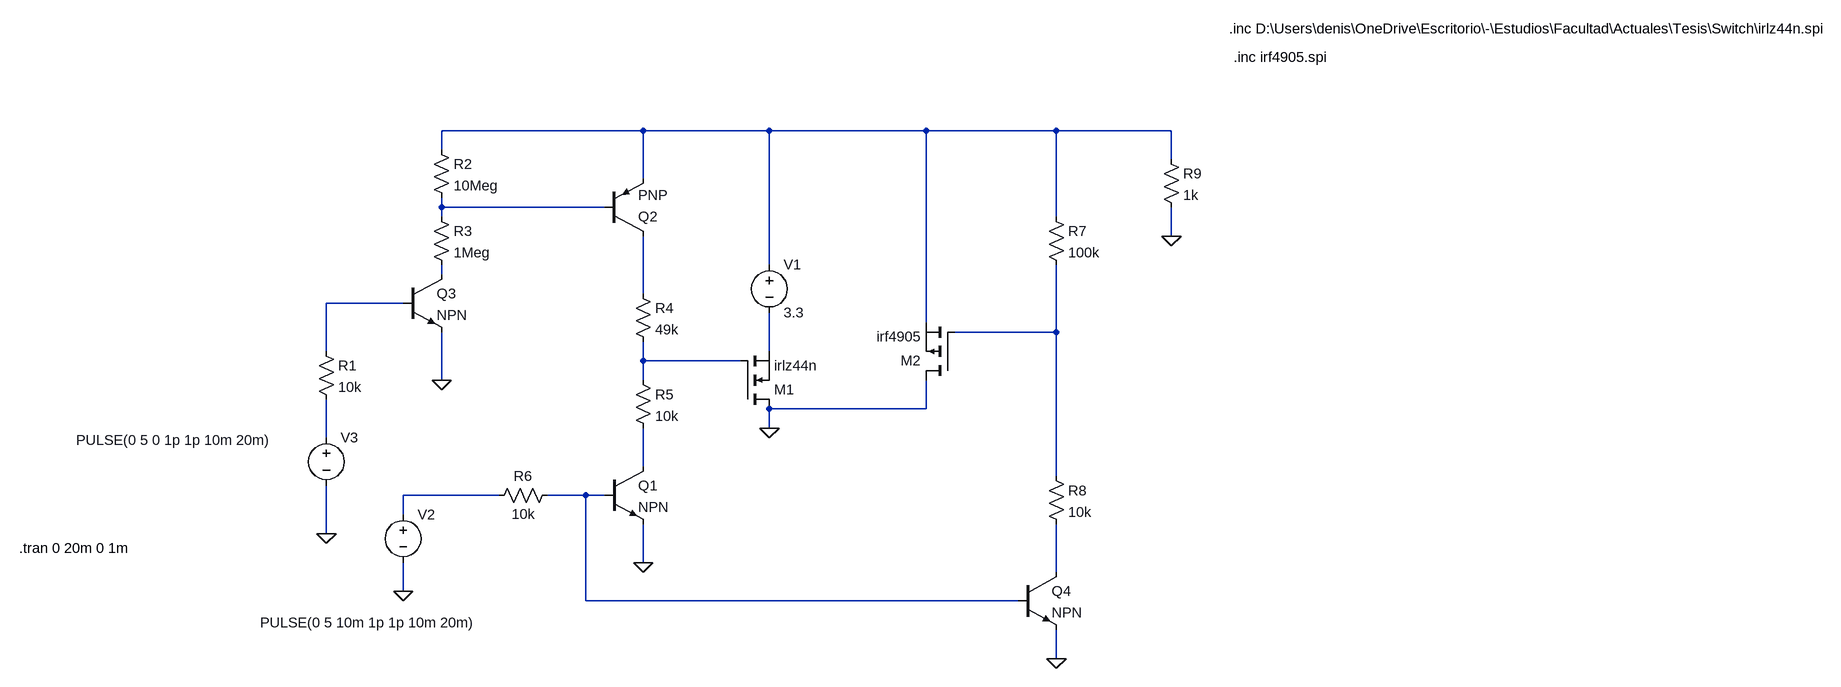
[diagram p0: schematic prueba_switch_completo_tbjs_ideales.asc]
prueba_switch_completo_tbjs_ideales.asc, the LTspice schematic file:
Version 4.1
SHEET 1 2348 1360
WIRE -112 -192 -448 -192
WIRE 160 -192 -112 -192
WIRE 496 -192 160 -192
WIRE 720 -192 496 -192
WIRE 1120 -192 720 -192
WIRE -448 -160 -448 -192
WIRE 1120 -144 1120 -192
WIRE -112 -112 -112 -192
WIRE -448 -64 -448 -80
WIRE -176 -64 -448 -64
WIRE -448 -48 -448 -64
WIRE 720 -48 720 -192
WIRE 1120 -16 1120 -64
WIRE 160 32 160 -192
WIRE -448 48 -448 32
WIRE -112 80 -112 -16
WIRE -512 96 -640 96
WIRE 496 128 496 -192
WIRE 720 144 720 32
WIRE 720 144 544 144
WIRE -640 176 -640 96
WIRE 160 176 160 112
WIRE -112 192 -112 160
WIRE 112 192 -112 192
WIRE -448 224 -448 144
WIRE -112 224 -112 192
WIRE 496 272 496 224
WIRE 496 272 160 272
WIRE 160 304 160 272
WIRE -640 320 -640 256
WIRE -112 368 -112 304
WIRE 720 384 720 144
WIRE -352 416 -512 416
WIRE -208 416 -272 416
WIRE -176 416 -208 416
WIRE -512 448 -512 416
WIRE -640 480 -640 400
WIRE -112 528 -112 464
WIRE 720 544 720 464
WIRE -512 576 -512 528
WIRE -208 592 -208 416
WIRE 656 592 -208 592
WIRE 720 688 720 640
FLAG 160 304 0
FLAG -112 528 0
FLAG -512 576 0
FLAG -448 224 0
FLAG -640 480 0
FLAG 720 688 0
FLAG 1120 -16 0
SYMBOL nmos 112 272 M180
SYMATTR InstName M1
SYMATTR Value irlz44n
SYMATTR Prefix X
SYMBOL npn -176 368 R0
SYMATTR InstName Q1
SYMBOL res -128 208 R0
SYMATTR InstName R5
SYMATTR Value 10k
SYMBOL voltage -512 432 R0
WINDOW 3 -238 196 Left 2
WINDOW 123 0 0 Left 0
WINDOW 39 0 0 Left 0
SYMATTR Value PULSE(0 5 10m 1p 1p 10m 20m)
SYMATTR InstName V2
SYMBOL res -128 64 R0
SYMATTR InstName R4
SYMATTR Value 49k
SYMBOL npn -512 48 R0
SYMATTR InstName Q3
SYMBOL res -464 -64 R0
SYMATTR InstName R3
SYMATTR Value 1Meg
SYMBOL res -464 -176 R0
SYMATTR InstName R2
SYMATTR Value 10Meg
SYMBOL res -656 160 R0
SYMATTR InstName R1
SYMATTR Value 10k
SYMBOL voltage -640 304 R0
WINDOW 3 -417 20 Left 2
WINDOW 123 0 0 Left 0
WINDOW 39 0 0 Left 0
SYMATTR Value PULSE(0 5 0 1p 1p 10m 20m)
SYMATTR InstName V3
SYMBOL res -256 400 R90
WINDOW 0 0 56 VBottom 2
WINDOW 3 32 56 VTop 2
SYMATTR InstName R6
SYMATTR Value 10k
SYMBOL voltage 160 16 R0
WINDOW 123 0 0 Left 0
WINDOW 39 0 0 Left 0
SYMATTR InstName V1
SYMATTR Value 3.3
SYMBOL pnp -176 -16 M180
SYMATTR InstName Q2
SYMBOL pmos 544 224 R180
SYMATTR InstName M2
SYMATTR Value irf4905
SYMATTR Prefix X
SYMBOL res 704 -64 R0
SYMATTR InstName R7
SYMATTR Value 100k
SYMBOL res 704 368 R0
SYMATTR InstName R8
SYMATTR Value 10k
SYMBOL npn 656 544 R0
SYMATTR InstName Q4
SYMBOL res 1104 -160 R0
SYMATTR InstName R9
SYMATTR Value 1k
TEXT -1152 504 Left 2 !.tran 0 20m 0 1m
TEXT 1216 -632 Left 2 !.inc D:\\Users\\denis\\OneDrive\\Escritorio\\-\\Estudios\\Facultad\\Actuales\\Tesis\\Switch\\irlz44n.spi
TEXT 1224 -584 Left 2 !.inc irf4905.spi

The netlist it stands for:
* prueba_switch_completo_tbjs_ideales.asc
X§M1 0 N008 N007 irlz44n  ; pins D G S
Q1 N010 N012 0 0 NPN
R5 N008 N010 10k
V2 N011 0 PULSE(0 5 10m 1p 1p 10m 20m)
R4 N004 N008 49k
Q3 N003 N005 0 0 NPN
R3 N002 N003 1Meg
R2 N001 N002 10Meg
R1 N005 N009 10k
V3 N009 0 PULSE(0 5 0 1p 1p 10m 20m)
R6 N012 N011 10k
V1 N001 N007 3.3
Q2 N004 N002 N001 0 PNP
X§M2 0 N006 N001 irf4905  ; pins D G S
R7 N001 N006 100k
R8 N006 N013 10k
Q4 N013 N012 0 0 NPN
R9 N001 0 1k
.model NPN NPN
.model PNP PNP
.lib standard.bjt
.tran 0 20m 0 1m
.inc D:\Users\denis\OneDrive\Escritorio\-\Estudios\Facultad\Actuales\Tesis\Switch\irlz44n.spi
.inc irf4905.spi
.backanno
.end